# EAGLE design V1.5 (EAGLE 9.4.2)
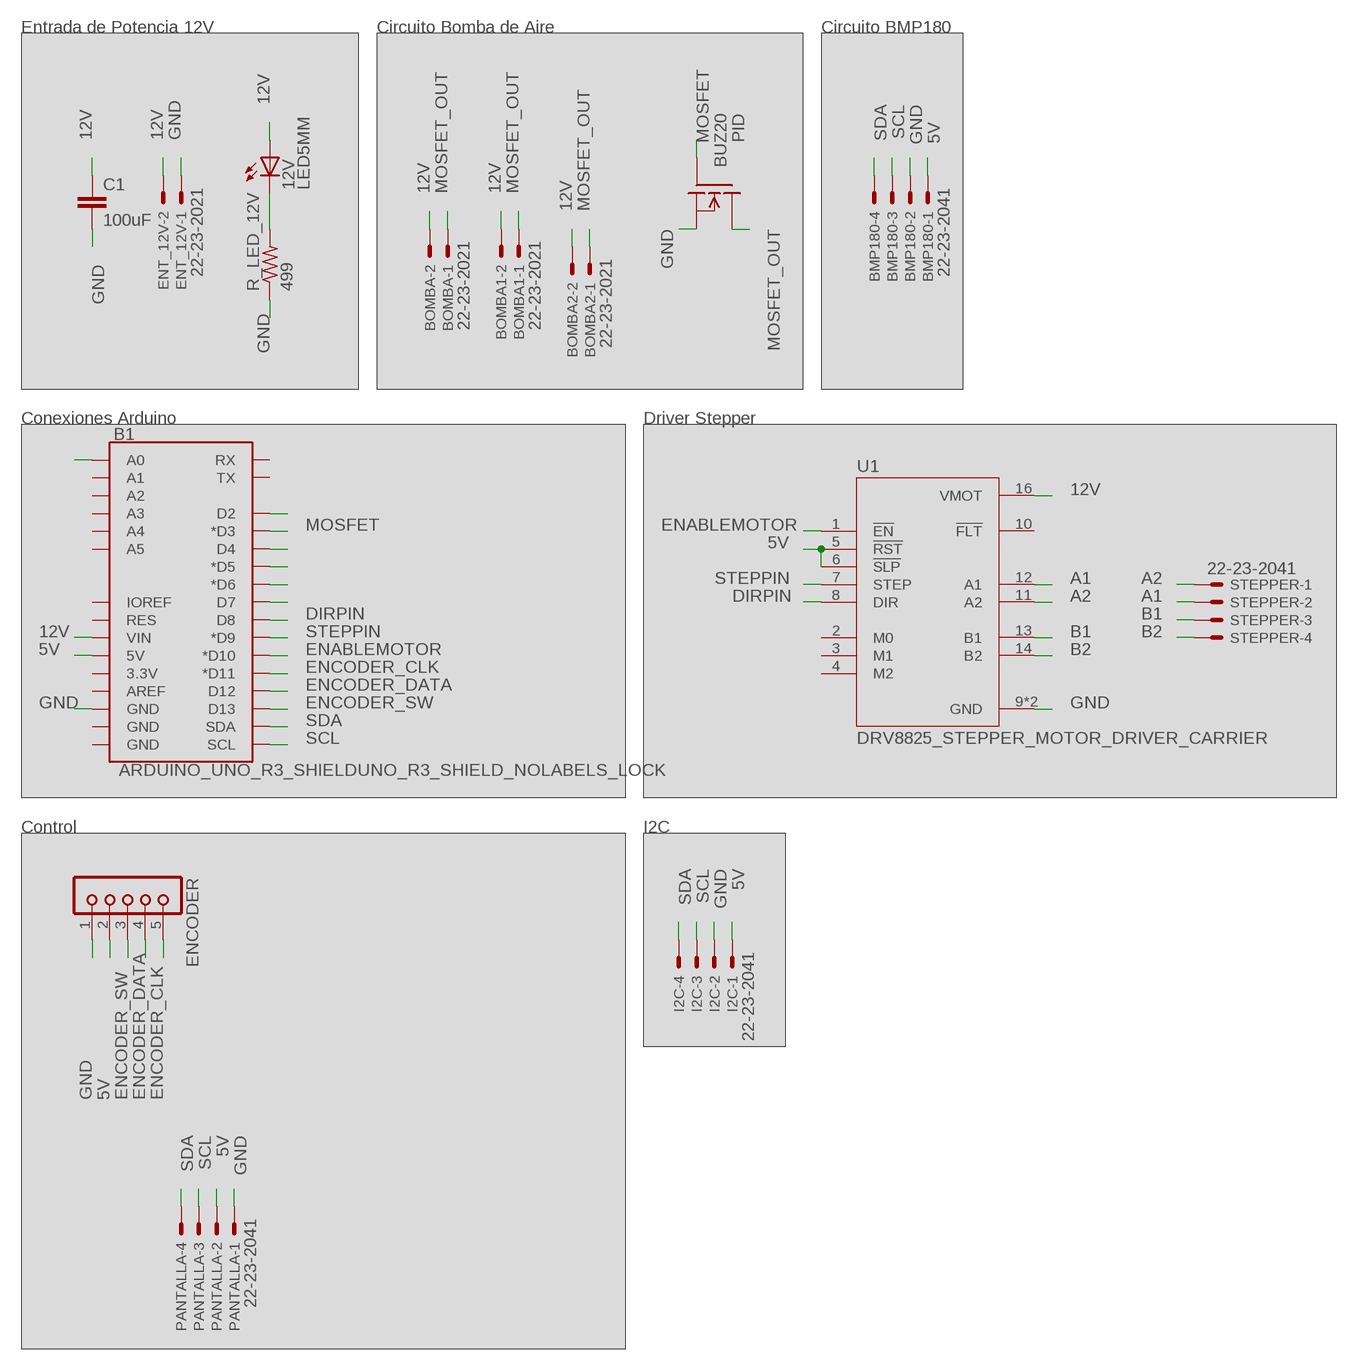
[diagram p0: schematic, sheet 1]

## Parts
12V  LED5MM  [5MM]
B1  ARDUINO_UNO_R3_SHIELDUNO_R3_SHIELD_NOLABELS_LOCK  [UNO_R3_SHIELD_NOLABELS_LOCK]
BMP180  22-23-2041  [22-23-2041]
BOMBA  22-23-2021  [22-23-2021]
BOMBA1  22-23-2021  [22-23-2021]
BOMBA2  22-23-2021  [22-23-2021]
C1  100uF  C2.5/5  [C2.5-5]
ENCODER  JU05  [JU05]
ENT_12V  22-23-2021  [22-23-2021]
I2C  22-23-2041  [22-23-2041]
PANTALLA  22-23-2041  [22-23-2041]
PID  BUZ20  [TO220]
R_LED_12V  499  R-US_0204/7  [0204/7]
STEPPER  22-23-2041  [22-23-2041]
U1  DRV8825_STEPPER_MOTOR_DRIVER_CARRIER  [IC_DRV8825_STEPPER_MOTOR_DRIVER_CARRIER]

## Nets
5V: B1.5V BMP180.1 ENCODER.2 I2C.1 PANTALLA.2 U1.5(!RST) U1.6(!SLP)
12V: 12V.IN(A) B1.VIN BOMBA1.2 BOMBA2.2 BOMBA.2 C1.1 ENT_12V.2 U1.16(VMOT)
A1: STEPPER.2 U1.12(A1)
A2: STEPPER.1 U1.11(A2)
B1: STEPPER.3 U1.13(B1)
B2: STEPPER.4 U1.14(B2)
BUTTON: B1.D2
DIRPIN: B1.D8 U1.8(DIR)
ENABLEMOTOR: B1.D10(*D10) U1.1(!EN)
ENCODER_CLK: B1.D11(*D11) ENCODER.5
ENCODER_DATA: B1.D12 ENCODER.4
ENCODER_SW: B1.D13 ENCODER.3
GND: B1.GND@2(GND) BMP180.2 C1.2 ENCODER.1 ENT_12V.1 I2C.2 PANTALLA.1 PID.3(S) R_LED_12V.1 U1.9(GND) U1.15(GND)
MOSFET: B1.D3(*D3) PID.1(G)
MOSFET_OUT: BOMBA1.1 BOMBA2.1 BOMBA.1 PID.2(D)
N$1: 12V.OUT(C) R_LED_12V.2
N$5: B1.D4
N$6: B1.D5(*D5)
N$7: B1.D6(*D6)
N$8: B1.D7
POT: B1.A0
SCL: B1.SCL BMP180.3 I2C.3 PANTALLA.3
SDA: B1.SDA BMP180.4 I2C.4 PANTALLA.4
STEPPIN: B1.D9(*D9) U1.7(STEP)
Unconnected: B1.3.3V B1.A1 B1.A2 B1.A3 B1.A4 B1.A5 B1.AREF B1.GND@0(GND) B1.GND@1(GND) B1.IOREF B1.RES B1.RX B1.TX U1.2(M0) U1.3(M1) U1.4(M2) U1.10(!FLT)

## Notes on the sheet
- Entrada de Potencia 12V | Circuito Bomba de Aire | Circuito BMP180
- Conexiones Arduino | Driver Stepper
- Control | I2C

## Library data of the parts
12V = fab:LED: LED
B1 = SparkFun-Boards:ARDUINO_UNO_R3_SHIELD: Arduino R3 Shield Footprint Shield form compatible with the Arduino Uno R3. SparkFun Products: MG2639 Cellular Shield <https://www.sparkfun.com/products/13120> MIDI Shield <https://www.sparkfun.com/products/12898> R3 Stackable Headers Kit <https://www.sparkfun.com/products/11417>
BMP180 I2C PANTALLA STEPPER = con-molex:22-23-2041: .100" (2.54mm) Center Header - 4 Pin; MF: MOLEX; MPN: 22-23-2041; OC_FARNELL: 1462920; OC_NEWARK: 38C0355
BOMBA BOMBA1 BOMBA2 ENT_12V = con-molex:22-23-2021: .100" (2.54mm) Center Header - 2 Pin; MF: MOLEX; MPN: 22-23-2021; OC_FARNELL: 1462926; OC_NEWARK: 25C3832
C1 = capacitor-wima:C: CAPACITOR naming: grid - package width
ENCODER = con-lsta:JU05: PIN HEADER; OC_FARNELL: unknown; OC_NEWARK: unknown
PID = transistor-fet:BUZ20: N-Channel Enhancement MOSFET 100V; 12A; 0,2Ohm
R_LED_12V = rcl:R-US_: RESISTOR, American symbol; SPICEPREFIX: R
U1 = DRV8825_STEPPER_MOTOR_DRIVER_CARRIER:DRV8825_STEPPER_MOTOR_DRIVER_CARRIER: Stepper motor controler; IC: DRV8825; 1.5A; Uin mot: 8.2÷45V; AVAILABILITY: Unavailable; DESCRIPTION: Stepper motor controler; IC: DRV8825; 1.5A; Uin mot: 8.2÷45V; MF: Pololu; MP: DRV8825 STEPPER MOTOR DRIVER CARRIER; PACKAGE: None; PRICE: None

## Board
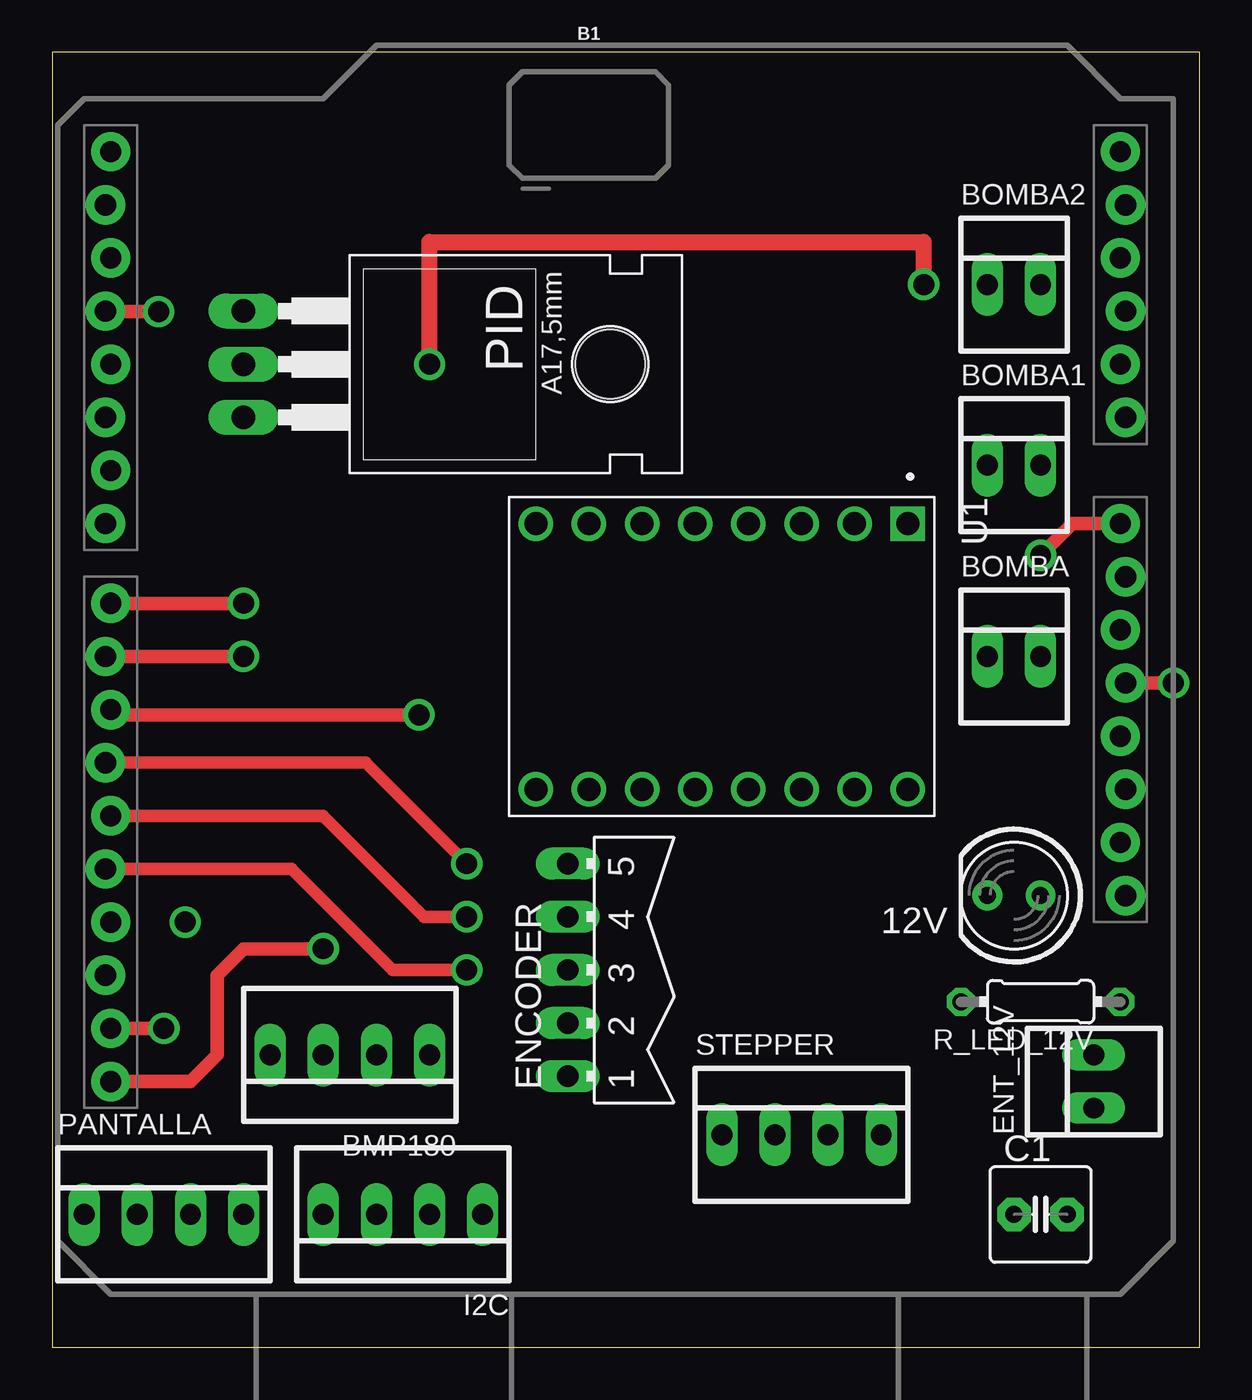
[diagram p1: board, top side]
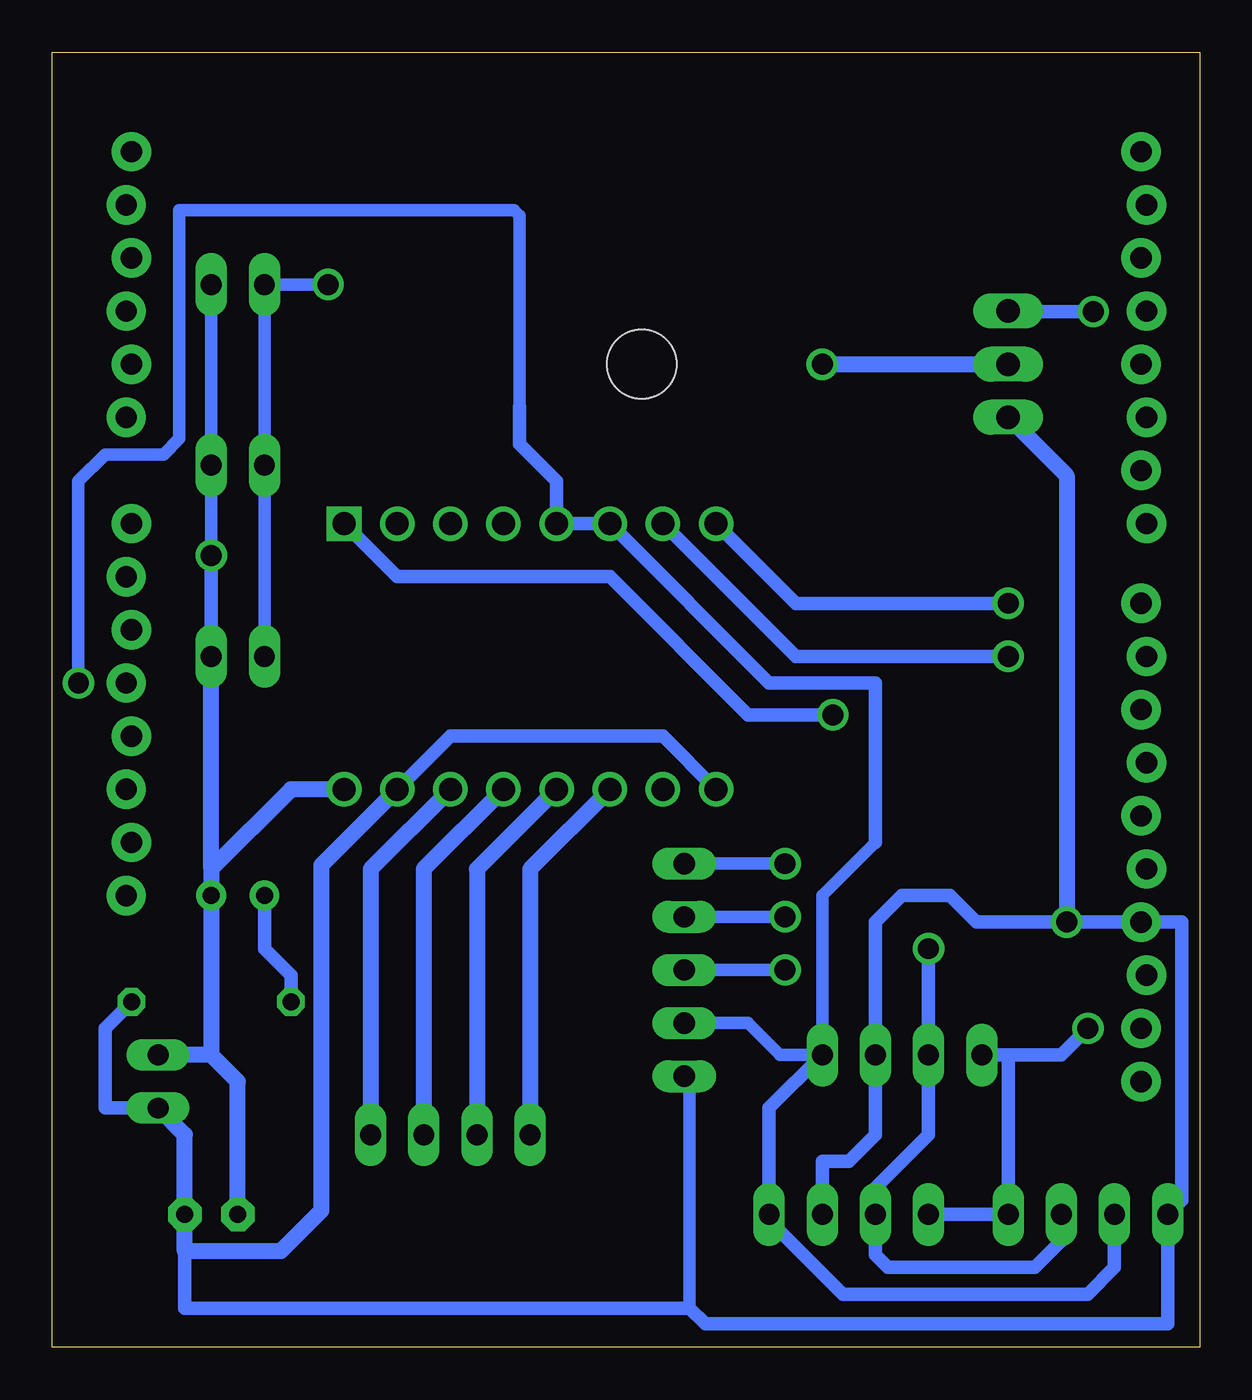
[diagram p2: board, bottom side, seen from below]

Size 54.84 x 61.9 mm. Coordinates in mm from the lower left corner, seen from the top.
Outline: 0,0 54.84,0 54.84,61.9 0,61.9 0,0
Copper layers (1*16): Top 0.035mm / dielectric 1.5mm / Bottom 0.035mm
Design rules "default *": minimum track width 0.6mm, minimum drill 0.35mm, track to track 0.4mm, track to pad 0.4mm, pad to pad 0.4mm, via to via 0.4mm, smd to smd 0.4mm, copper to edge 0.4mm, drill to drill 0.4mm, minimum pad ring 10mil, minimum via ring 8mil, stop-mask expansion 4mil, vias tented up to drill 0mil, thermal gap 10mil

### Footprints (pad centres in the part's own frame; a part is rotated, then mirrored left to right if it is on the bottom)
5MM = drill 0.813 pad 1.422: IN -1.27,0; OUT 1.27,0
UNO_R3_SHIELD_NOLABELS_LOCK = drill 1.016 pad 1.88: 3.3V 24.13,-3.81; 5V 24.384,-1.27; A0 24.384,11.43; A1 24.13,13.97; A2 24.384,16.51; A3 24.13,19.05; A4 24.384,21.59; A5 24.13,24.13; AREF -24.384,-15.24; D2 -24.13,19.05; D3 -24.384,16.51; D4 -24.13,13.97; D5 -24.384,11.43; D6 -24.13,8.89; D7 -24.384,6.35; D8 -24.13,2.54; D9 -24.384,0; D10 -24.13,-2.54; D11 -24.384,-5.08; D12 -24.13,-7.62; D13 -24.384,-10.16; GND@0 24.13,1.27; GND@1 24.384,3.81; GND@2 -24.13,-12.7; IOREF 24.13,-8.89; NC 24.384,-11.43; RES 24.384,-6.35; RX -24.13,24.13; SCL -24.13,-20.32; SDA -24.13,-17.78; TX -24.384,21.59; VIN 24.13,6.35
22-23-2041 = drill 1 long: 1 -3.81,0; 2 -1.27,0; 3 1.27,0; 4 3.81,0
22-23-2021 = drill 1 long: 1 -1.27,0; 2 1.27,0
C2.5-5 = drill 0.813 pad 1.6 octagon: 1 -1.27,0; 2 1.27,0
JU05 = drill 1.016 long: 1 -5.08,0; 2 -2.54,0; 3 0,0; 4 2.54,0; 5 5.08,0
TO220 = drill 1.118 long: 1 -2.54,-6.35; 2 0,-6.35; 3 2.54,-6.35 | hole 3.302: 0,11.176
0204/7 = drill 0.813 octagon: 1 -3.81,0; 2 3.81,0
IC_DRV8825_STEPPER_MOTOR_DRIVER_CARRIER = drill 1.1 square: 1 -6.35,8.89 | drill 1.1: 2 -6.35,6.35; 3 -6.35,3.81; 4 -6.35,1.27; 5 -6.35,-1.27; 6 -6.35,-3.81; 7 -6.35,-6.35; 8 -6.35,-8.89; 9 6.35,-8.89; 10 6.35,-6.35; 11 6.35,-3.81; 12 6.35,-1.27; 13 6.35,1.27; 14 6.35,3.81; 15 6.35,6.35; 16 6.35,8.89

### Placement (x,y rotation side)
12V  45.97,21.59 180 top
B1  26.92,33.02 0 top
BMP180  14.22,13.97 180 top
BOMBA  45.97,33.02 0 top
BOMBA1  45.97,42.16 0 top
BOMBA2  45.97,50.8 0 top
C1  47.24,6.35 0 top
ENCODER  24.64,18.03 90 top
ENT_12V  49.78,12.7 90 top
I2C  16.76,6.35 180 top
PANTALLA  5.33,6.35 0 top
PID  15.49,46.99 270 top
R_LED_12V  47.24,16.51 180 top
STEPPER  35.81,10.16 0 top
U1  32,33.02 270 top

### Tracks (layer width: path | path; a pad name or v marks a point on that pad's centre or on a via)
5V  (via drill 1)
  Top 0.635: B1.5V v53.59,31.75
  Bottom 0.6: 15.49,24.13 18.03,21.59 BMP180.1 20.07,13.97 21.59,15.49 ENCODER.2 | v53.59,31.75 53.59,41.4 52.32,42.67 49.53,42.67 48.77,43.43 48.77,54.36 32.77,54.36 32.51,54.1 32.51,44.96
  Bottom 0.635: 32.51,44.96 32.51,43.18 30.73,41.4 U1.5 U1.6 20.57,31.75 15.49,31.75 15.49,24.13 | BMP180.1 20.57,11.43 I2C.1 20.57,6.05 17.06,2.54 5.33,2.54 4.06,3.81 PANTALLA.2
12V  (via drill 1)
  Top 0.635: B1.VIN 48.77,39.37 v47.24,37.85
  Bottom 0.6: BOMBA.2 BOMBA1.2 BOMBA2.2
  Bottom 0.635: BOMBA.2 v47.24,37.85
  Bottom 0.762: 47.24,13.97 12V.IN 47.24,22.86 | 47.24,13.97 ENT_12V.2 | C1.1 45.97,12.7 47.24,13.97 | U1.16 43.43,26.67 47.24,22.86 | 47.24,22.86 BOMBA.2
A1
  Bottom 0.762: U1.12 34.54,22.86 STEPPER.2
A2
  Bottom 0.762: U1.11 32,22.86 STEPPER.1
B1
  Bottom 0.762: U1.13 37.08,22.86 STEPPER.3
B2
  Bottom 0.762: U1.14 39.62,22.86 STEPPER.4
DIRPIN  (via drill 1)
  Top 0.635: B1.D8 v9.14,35.56
  Bottom 0.635: U1.8 19.3,35.56 v9.14,35.56
ENABLEMOTOR  (via drill 1)
  Top 0.635: v17.53,30.23 3.05,30.23 B1.D10
  Bottom 0.635: U1.1 38.35,36.83 28.19,36.83 21.59,30.23 v17.53,30.23
ENCODER_CLK  (via drill 1)
  Top 0.6: B1.D11 14.99,27.94 v19.81,23.11
  Bottom 0.6: ENCODER.5 v19.81,23.11
ENCODER_DATA  (via drill 1)
  Top 0.6: B1.D12 12.95,25.4 17.78,20.57 v19.81,20.57
  Bottom 0.6: ENCODER.4 v19.81,20.57
ENCODER_SW  (via drill 1)
  Top 0.6: B1.D13 11.43,22.86 16.26,18.03 v19.81,18.03
  Bottom 0.6: ENCODER.3 v19.81,18.03
GND  (via drill 1)
  Bottom 0.6: 24.38,1.87 24.38,12.7 ENCODER.1
  Bottom 0.635: ENT_12V.1 52.32,11.43 52.32,15.24 R_LED_12V.1 | U1.9 25.65,29.21 35.81,29.21 U1.15 | I2C.2 18.03,8.89 16.76,8.89 15.49,10.16 BMP180.2 15.49,20.32 14.22,21.59 11.94,21.59 10.67,20.32 v6.35,20.32 B1.GND@2 0.85,20.32 0.85,7.02 PANTALLA.1 1.52,1.11 23.62,1.11 24.38,1.87 48.51,1.87 48.51,4.59
  Bottom 0.762: ENT_12V.1 48.51,10.16 C1.2 48.51,4.59 43.92,4.59 41.99,6.52 41.99,23.03 U1.15 | PID.3 6.35,41.66 v6.35,20.32
MOSFET  (via drill 1)
  Top 0.635: v5.08,49.51 2.56,49.51 B1.D3
  Bottom 0.635: PID.1 9.12,49.51 v5.08,49.51
MOSFET_OUT  (via drill 1)
  Top 0.762: v41.66,50.8 41.66,52.83 18.03,52.83 v18.03,46.99
  Bottom 0.6: v41.66,50.8 BOMBA2.1 BOMBA1.1 BOMBA.1
  Bottom 0.762: v18.03,46.99 PID.2
N$1
  Bottom 0.635: 12V.OUT 44.7,19.05 43.43,17.78 R_LED_12V.2
SCL  (via drill 1)
  Top 0.635: B1.SCL 6.6,12.7 7.87,13.97 7.87,17.78 9.14,19.05 v12.95,19.05
  Bottom 0.635: v12.95,19.05 BMP180.3 12.95,10.16 15.49,7.62 I2C.3 15.49,4.41 14.89,3.81 7.87,3.81 6.6,5.08 PANTALLA.3
SDA  (via drill 1)
  Top 0.635: B1.SDA v5.33,15.24
  Bottom 0.635: v5.33,15.24 6.6,13.97 9.14,13.97 | 9.14,13.97 BMP180.4 | I2C.4 PANTALLA.4 9.14,13.97
STEPPIN  (via drill 1)
  Top 0.635: B1.D9 v9.14,33.02
  Bottom 0.635: U1.7 19.3,33.02 v9.14,33.02